# EAGLE board MEM_MUX_2W_1 (EAGLE 6.5.0)
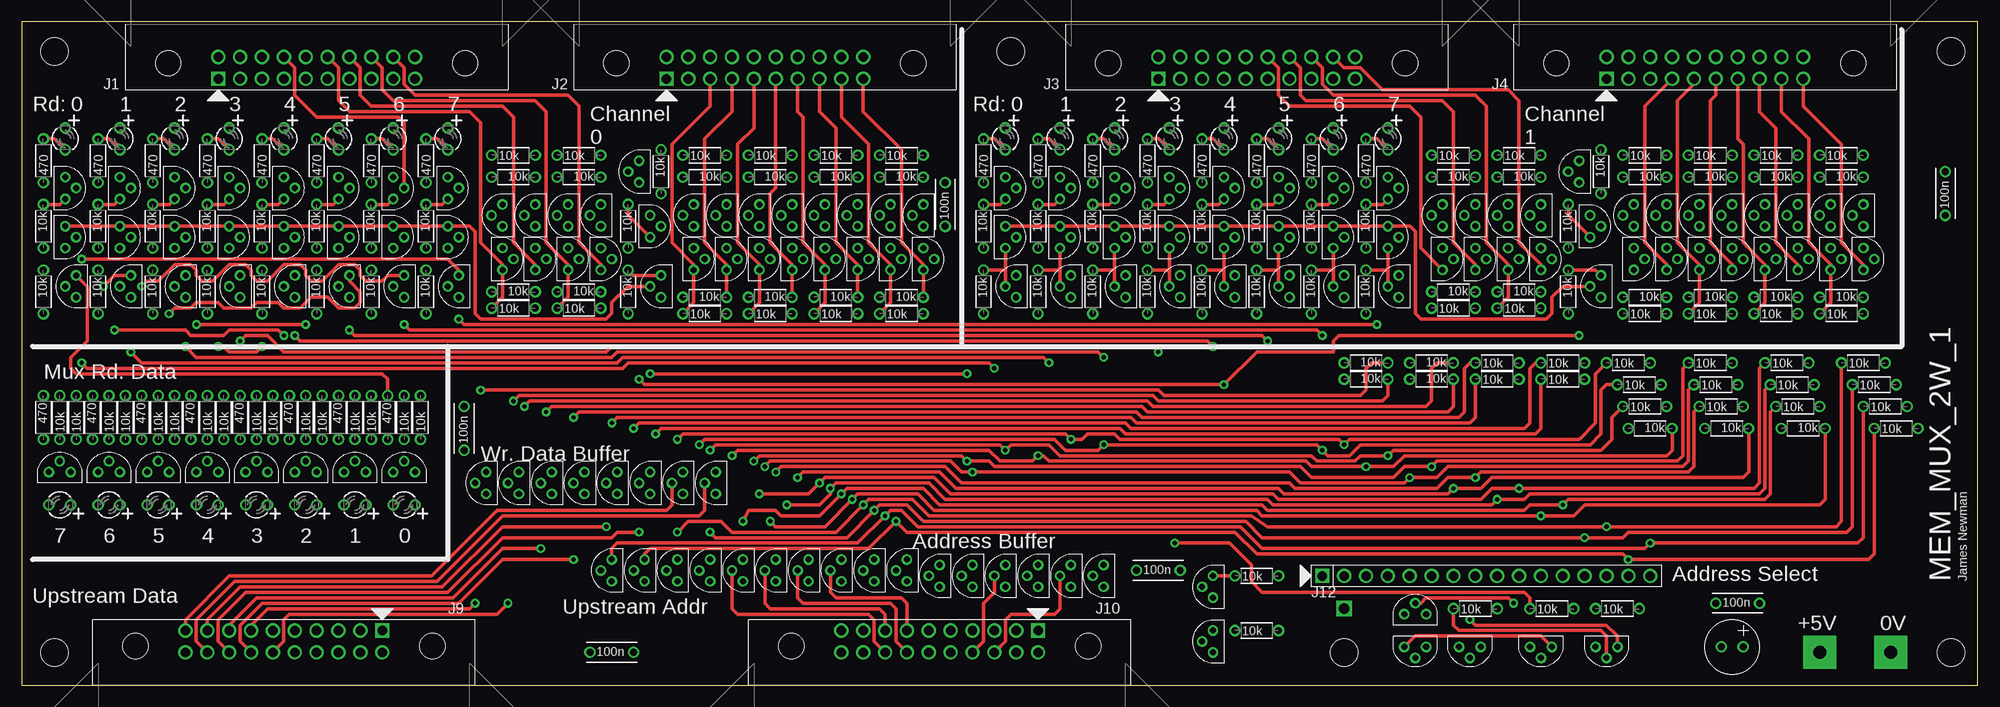
[diagram p12: board, top side]
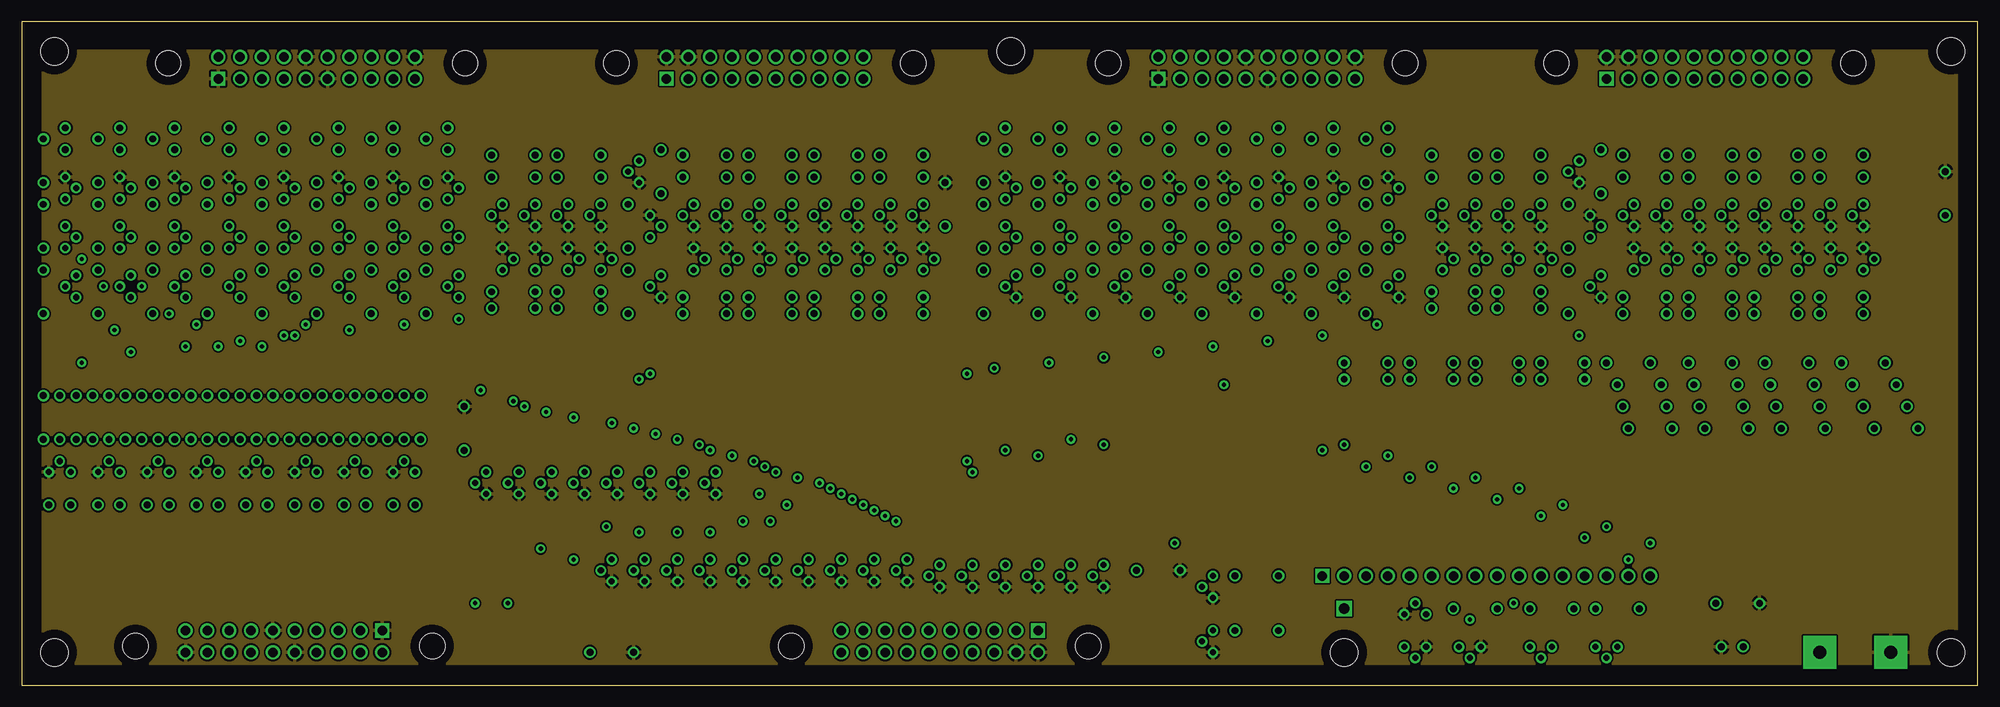
[diagram p13: board, inner layer Route2]
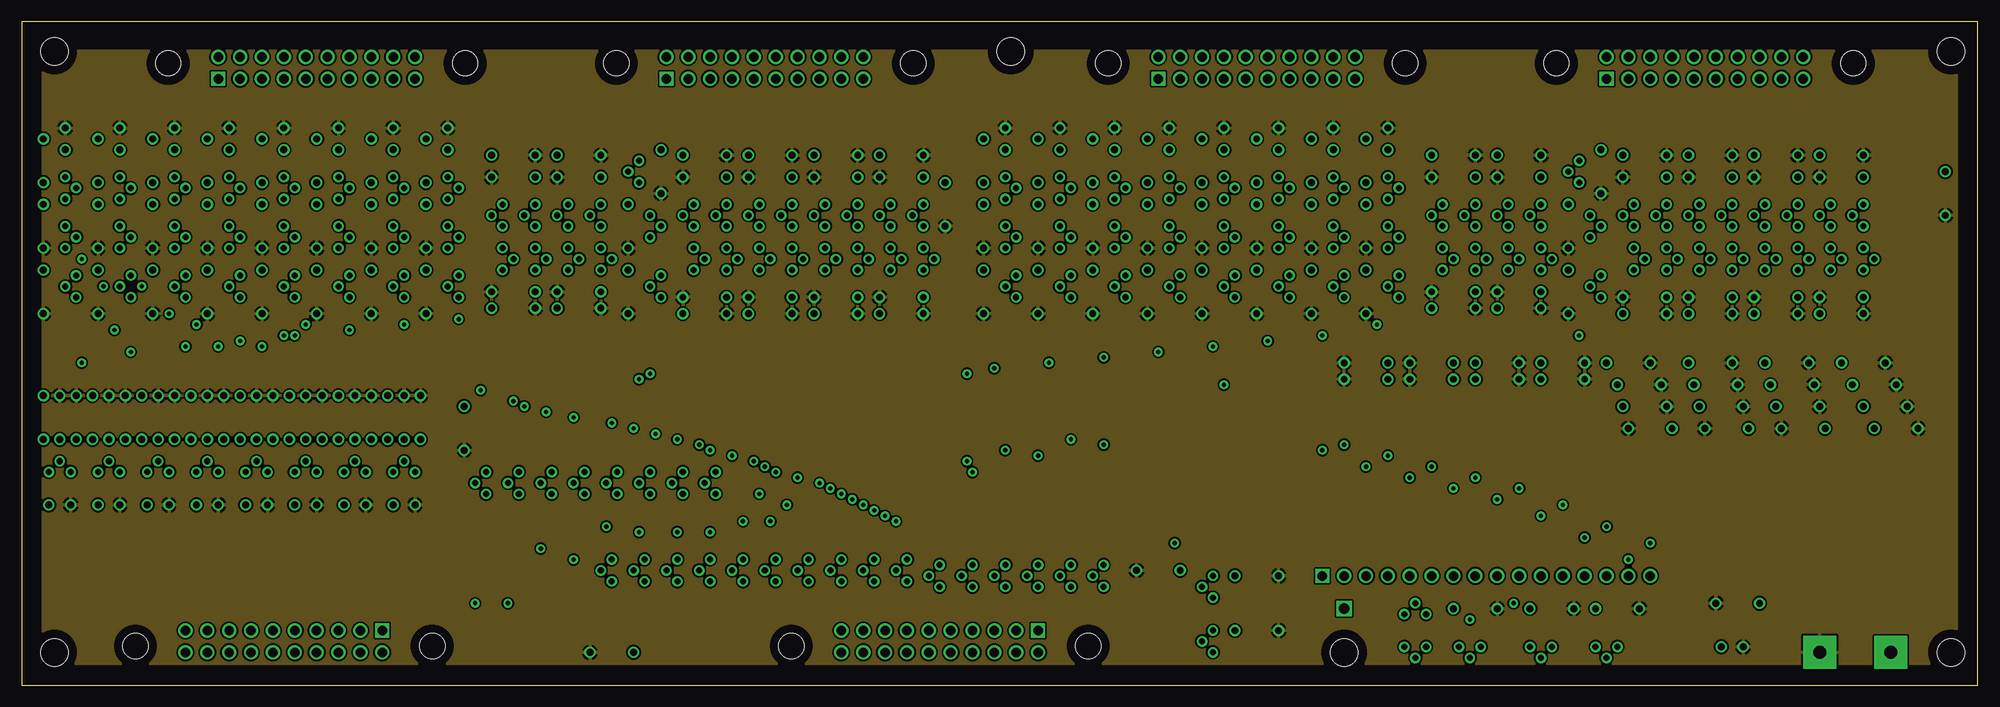
[diagram p14: board, inner layer Route3]
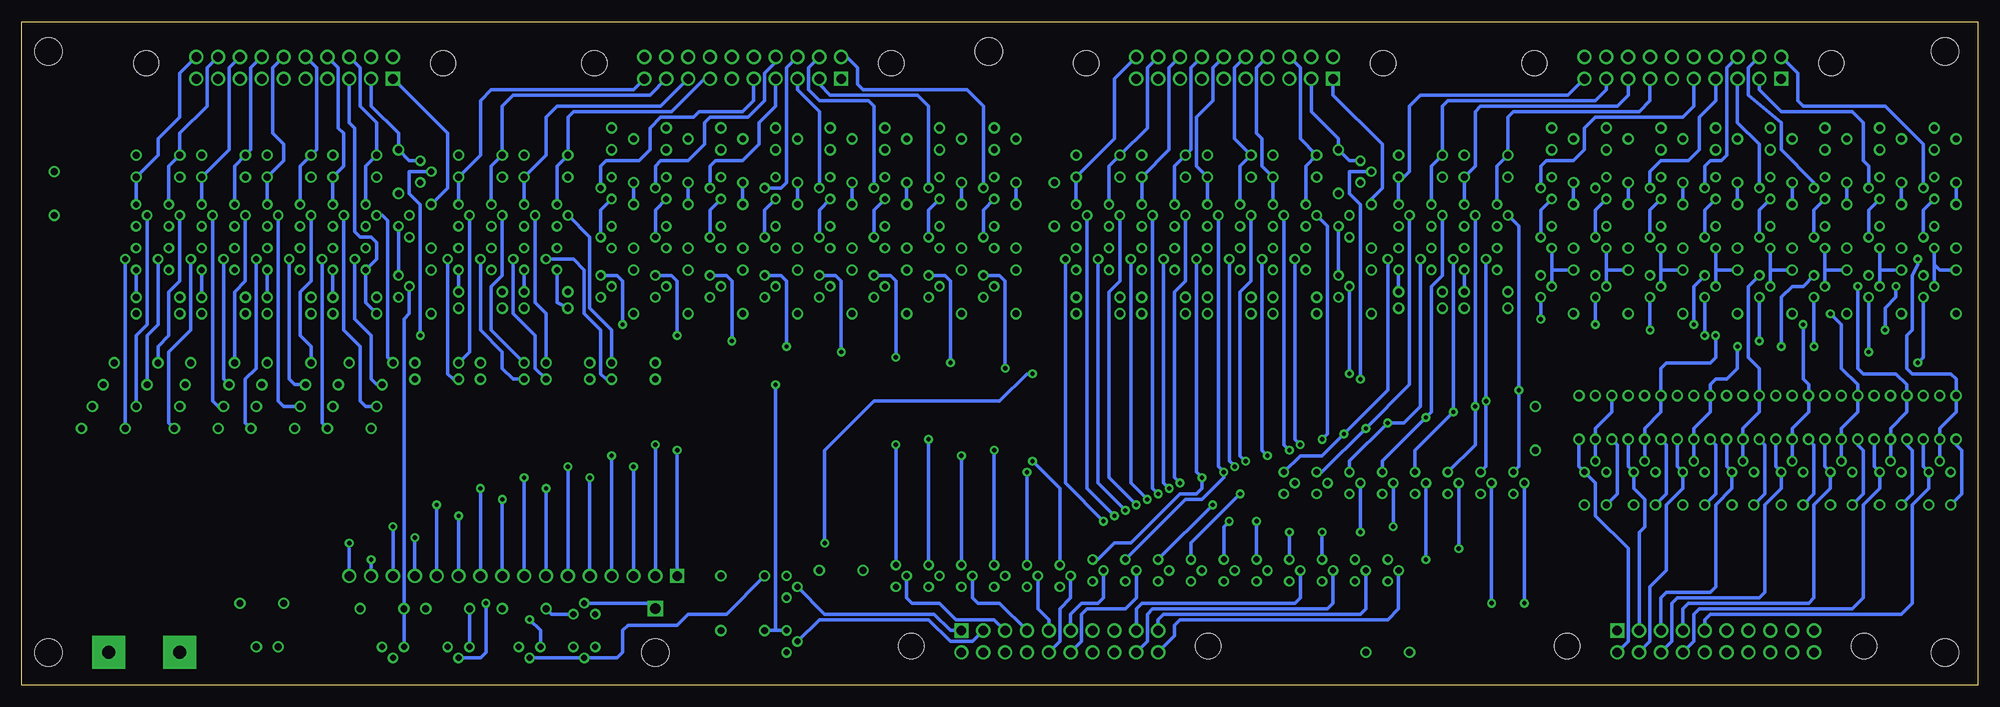
[diagram p15: board, bottom side, seen from below]

Size 227.31 x 77.14 mm. Coordinates in mm from the lower left corner, seen from the top.
Outline: 0,0 227.31,0 227.31,77.14 0,77.14 0,0
Copper layers (1*2+3*16): Top 0.035mm / dielectric 0.2mm / Route2 0.035mm / dielectric 1mm / Route3 0.035mm / dielectric 0.2mm / Bottom 0.035mm
Design rules "processor_rules_4layer": minimum track width 10mil, minimum drill 0.0236mm, track to track 8mil, track to pad 8mil, pad to pad 8mil, via to via 8mil, smd to smd 8mil, copper to edge 40mil, drill to drill 8mil, minimum pad ring 10mil, minimum via ring 8mil, stop-mask expansion 4mil, vias tented up to drill 0.7mm, thermal gap 10mil

## Footprints (pad centres in the part's own frame; a part is rotated, then mirrored left to right if it is on the bottom)
CAP_P2INCH = drill 0.8: 1 -2.54,0; 2 2.54,0
POLARISED_CAP_2P5_6P3MM = drill 0.8: A 1.27,0; K -1.27,0
LED3MM = drill 0.8: A -1.27,0; K 1.27,0
3M_HOLE = hole 3.2: 0,0
20_HDR_LOCKING_RA = drill 1.1 square: 1 -11.43,-1.27 | drill 1.1: 2 -11.43,1.27; 3 -8.89,-1.27; 4 -8.89,1.27; 5 -6.35,-1.27; 6 -6.35,1.27; 7 -3.81,-1.27; 8 -3.81,1.27; 9 -1.27,-1.27; 10 -1.27,1.27; 11 1.27,-1.27; 12 1.27,1.27; 13 3.81,-1.27; 14 3.81,1.27; 15 6.35,-1.27; 16 6.35,1.27; 17 8.89,-1.27; 18 8.89,1.27; 19 11.43,-1.27; 20 11.43,1.27 | hole 2.946: -17.247,0.533; 17.247,0.533
JUMP_16X1 = drill 1.1 square: 1 -19.05,0 | drill 1.1: 2 -16.51,0; 3 -13.97,0; 4 -11.43,0; 5 -8.89,0; 6 -6.35,0; 7 -3.81,0; 8 -1.27,0; 9 1.27,0; 10 3.81,0; 11 6.35,0; 12 8.89,0; 13 11.43,0; 14 13.97,0; 15 16.51,0; 16 19.05,0
TO92-DGS = drill 0.7: D 0,1.27; G -1.27,0; S 0,-1.27
R_P2INCH = drill 0.8: 1 -2.54,0; 2 2.54,0
TEST_LOOP = drill 1.2 square: P$1 0,0
POWER_PAD = drill 1.5 pad 3.81 square: 1 0,0

## Placement (x,y rotation side)
C1  100n  [CAP_P2INCH]  223.52,57.15 90 top
C2  100n  [CAP_P2INCH]  51.44,29.84 90 top
C3  100n  [CAP_P2INCH]  107.31,55.88 90 top
C4  100n  [CAP_P2INCH]  199.39,9.53 0 top
C5  100n  [CAP_P2INCH]  68.58,3.81 0 top
C6  100n  [CAP_P2INCH]  132.08,13.34 0 top
C7  100u  [POLARISED_CAP_2P5_6P3MM]  198.75,4.45 0 top
D1  L-1334SRT  [LED3MM]  5.08,63.5 270 top
D2  L-1334SRT  [LED3MM]  11.43,63.5 270 top
D3  L-1334SRT  [LED3MM]  17.78,63.5 270 top
D4  L-1334SRT  [LED3MM]  24.13,63.5 270 top
D5  L-1334SRT  [LED3MM]  30.48,63.5 270 top
D6  L-1334SRT  [LED3MM]  36.83,63.5 270 top
D7  L-1334SRT  [LED3MM]  43.18,63.5 270 top
D8  L-1334SRT  [LED3MM]  49.53,63.5 270 top
D9  L-1334SRT  [LED3MM]  114.3,63.5 270 top
D10  L-1334SRT  [LED3MM]  120.65,63.5 270 top
D11  L-1334SRT  [LED3MM]  127,63.5 270 top
D12  L-1334SRT  [LED3MM]  133.35,63.5 270 top
D13  L-1334SRT  [LED3MM]  139.7,63.5 270 top
D14  L-1334SRT  [LED3MM]  146.05,63.5 270 top
D15  L-1334SRT  [LED3MM]  152.4,63.5 270 top
D16  L-1334SRT  [LED3MM]  158.75,63.5 270 top
D33  L-1334SRT  [LED3MM]  38.73,20.95 180 top
D34  L-1334SRT  [LED3MM]  33.02,20.95 180 top
D35  L-1334SRT  [LED3MM]  27.3,20.95 180 top
D36  L-1334SRT  [LED3MM]  21.59,20.95 180 top
D37  L-1334SRT  [LED3MM]  15.88,20.95 180 top
D38  L-1334SRT  [LED3MM]  10.16,20.95 180 top
D39  L-1334SRT  [LED3MM]  4.45,20.95 180 top
D69  L-1334SRT  [LED3MM]  44.45,20.95 180 top
H2  3M_MOUNT_HOLE  [3M_HOLE]  3.81,3.81 0 top
H3  3M_MOUNT_HOLE  [3M_HOLE]  3.81,73.66 0 top
H5  3M_MOUNT_HOLE  [3M_HOLE]  114.94,73.66 0 top
H6  3M_MOUNT_HOLE  [3M_HOLE]  224.16,73.66 0 top
H9  3M_MOUNT_HOLE  [3M_HOLE]  224.16,3.81 0 top
H10  3M_MOUNT_HOLE  [3M_HOLE]  153.67,3.81 0 top
J1  20_HDR_LOCKING_RA  [20_HDR_LOCKING_RA]  34.29,71.75 0 top
J2  20_HDR_LOCKING_RA  [20_HDR_LOCKING_RA]  86.36,71.75 0 top
J3  20_HDR_LOCKING_RA  [20_HDR_LOCKING_RA]  143.51,71.75 0 top
J4  20_HDR_LOCKING_RA  [20_HDR_LOCKING_RA]  195.58,71.75 0 top
J9  20_HDR_LOCKING_RA  [20_HDR_LOCKING_RA]  30.48,5.08 180 top
J10  20_HDR_LOCKING_RA  [20_HDR_LOCKING_RA]  106.68,5.08 180 top
J12  JUMP_16X1  [JUMP_16X1]  170.18,12.7 0 top
Q1  2N7000  [TO92-DGS]  5.08,57.78 180 top
Q2  2N7000  [TO92-DGS]  5.08,52.07 180 top
Q3  2N7000  [TO92-DGS]  11.43,57.78 180 top
Q4  2N7000  [TO92-DGS]  11.43,52.07 180 top
Q5  2N7000  [TO92-DGS]  17.78,57.78 180 top
Q6  2N7000  [TO92-DGS]  17.78,52.07 180 top
Q7  2N7000  [TO92-DGS]  24.13,57.78 180 top
Q8  2N7000  [TO92-DGS]  24.13,52.07 180 top
Q9  2N7000  [TO92-DGS]  30.48,57.78 180 top
Q10  2N7000  [TO92-DGS]  30.48,52.07 180 top
Q11  2N7000  [TO92-DGS]  36.83,57.78 180 top
Q12  2N7000  [TO92-DGS]  36.83,52.07 180 top
Q13  2N7000  [TO92-DGS]  43.18,57.78 180 top
Q14  2N7000  [TO92-DGS]  43.18,52.07 180 top
Q15  2N7000  [TO92-DGS]  49.53,57.78 180 top
Q16  2N7000  [TO92-DGS]  49.53,52.07 180 top
Q17  2N7000  [TO92-DGS]  78.11,49.53 180 top
Q18  2N7000  [TO92-DGS]  78.11,54.61 0 top
Q19  2N7000  [TO92-DGS]  81.92,49.53 180 top
Q20  2N7000  [TO92-DGS]  81.92,54.61 0 top
Q21  2N7000  [TO92-DGS]  85.72,49.53 180 top
Q22  2N7000  [TO92-DGS]  85.72,54.61 0 top
Q23  2N7000  [TO92-DGS]  73.03,53.34 180 top
Q24  2N7000  [TO92-DGS]  71.75,59.69 0 top
Q25  2N7000  [TO92-DGS]  55.88,49.53 180 top
Q26  2N7000  [TO92-DGS]  55.88,54.61 0 top
Q27  2N7000  [TO92-DGS]  59.69,49.53 180 top
Q28  2N7000  [TO92-DGS]  59.69,54.61 0 top
Q29  2N7000  [TO92-DGS]  63.5,49.53 180 top
Q30  2N7000  [TO92-DGS]  63.5,54.61 0 top
Q31  2N7000  [TO92-DGS]  67.31,49.53 180 top
Q32  2N7000  [TO92-DGS]  67.31,54.61 0 top
Q33  2N7000  [TO92-DGS]  89.53,49.53 180 top
Q34  2N7000  [TO92-DGS]  89.53,54.61 0 top
Q35  2N7000  [TO92-DGS]  93.34,49.53 180 top
Q36  2N7000  [TO92-DGS]  93.34,54.61 0 top
Q37  2N7000  [TO92-DGS]  97.16,49.53 180 top
Q38  2N7000  [TO92-DGS]  97.16,54.61 0 top
Q39  2N7000  [TO92-DGS]  100.97,49.53 180 top
Q40  2N7000  [TO92-DGS]  100.97,54.61 0 top
Q41  2N7000  [TO92-DGS]  104.78,49.53 180 top
Q42  2N7000  [TO92-DGS]  104.78,54.61 0 top
Q43  2N7000  [TO92-DGS]  114.3,57.78 180 top
Q44  2N7000  [TO92-DGS]  114.3,52.07 180 top
Q45  2N7000  [TO92-DGS]  120.65,57.78 180 top
Q46  2N7000  [TO92-DGS]  120.65,52.07 180 top
Q47  2N7000  [TO92-DGS]  127,57.78 180 top
Q48  2N7000  [TO92-DGS]  127,52.07 180 top
Q49  2N7000  [TO92-DGS]  133.35,57.78 180 top
Q50  2N7000  [TO92-DGS]  133.35,52.07 180 top
Q51  2N7000  [TO92-DGS]  139.7,57.78 180 top
Q52  2N7000  [TO92-DGS]  139.7,52.07 180 top
Q53  2N7000  [TO92-DGS]  146.05,57.78 180 top
Q54  2N7000  [TO92-DGS]  146.05,52.07 180 top
Q55  2N7000  [TO92-DGS]  152.4,57.78 180 top
Q56  2N7000  [TO92-DGS]  152.4,52.07 180 top
Q57  2N7000  [TO92-DGS]  158.75,57.78 180 top
Q58  2N7000  [TO92-DGS]  158.75,52.07 180 top
Q59  2N7000  [TO92-DGS]  182.25,53.34 180 top
Q60  2N7000  [TO92-DGS]  180.97,59.69 0 top
Q61  2N7000  [TO92-DGS]  165.1,49.53 180 top
Q62  2N7000  [TO92-DGS]  165.1,54.61 0 top
Q63  2N7000  [TO92-DGS]  168.91,49.53 180 top
Q64  2N7000  [TO92-DGS]  168.91,54.61 0 top
Q65  2N7000  [TO92-DGS]  172.72,49.53 180 top
Q66  2N7000  [TO92-DGS]  172.72,54.61 0 top
Q67  2N7000  [TO92-DGS]  176.53,49.53 180 top
Q68  2N7000  [TO92-DGS]  176.53,54.61 0 top
Q69  2N7000  [TO92-DGS]  187.32,49.53 180 top
Q70  2N7000  [TO92-DGS]  187.32,54.61 0 top
Q71  2N7000  [TO92-DGS]  191.13,49.53 180 top
Q72  2N7000  [TO92-DGS]  191.13,54.61 0 top
Q73  2N7000  [TO92-DGS]  194.94,49.53 180 top
Q74  2N7000  [TO92-DGS]  194.94,54.61 0 top
Q75  2N7000  [TO92-DGS]  198.75,49.53 180 top
Q76  2N7000  [TO92-DGS]  198.75,54.61 0 top
Q77  2N7000  [TO92-DGS]  202.56,49.53 180 top
Q78  2N7000  [TO92-DGS]  202.56,54.61 0 top
Q79  2N7000  [TO92-DGS]  206.38,49.53 180 top
Q80  2N7000  [TO92-DGS]  206.38,54.61 0 top
Q81  2N7000  [TO92-DGS]  210.19,49.53 180 top
Q82  2N7000  [TO92-DGS]  210.19,54.61 0 top
Q83  2N7000  [TO92-DGS]  214,49.53 180 top
Q84  2N7000  [TO92-DGS]  214,54.61 0 top
Q169  2N7000  [TO92-DGS]  6.35,46.35 0 top
Q170  2N7000  [TO92-DGS]  44.45,24.77 270 top
Q171  2N7000  [TO92-DGS]  115.57,46.35 0 top
Q174  2N7000  [TO92-DGS]  12.7,46.35 0 top
Q175  2N7000  [TO92-DGS]  38.73,24.77 270 top
Q176  2N7000  [TO92-DGS]  121.92,46.35 0 top
Q179  2N7000  [TO92-DGS]  19.05,46.35 0 top
Q180  2N7000  [TO92-DGS]  33.02,24.77 270 top
Q181  2N7000  [TO92-DGS]  128.27,46.35 0 top
Q184  2N7000  [TO92-DGS]  25.4,46.35 0 top
Q185  2N7000  [TO92-DGS]  27.3,24.77 270 top
Q186  2N7000  [TO92-DGS]  134.62,46.35 0 top
Q189  2N7000  [TO92-DGS]  31.75,46.35 0 top
Q190  2N7000  [TO92-DGS]  21.59,24.77 270 top
Q191  2N7000  [TO92-DGS]  140.97,46.35 0 top
Q194  2N7000  [TO92-DGS]  38.1,46.35 0 top
Q195  2N7000  [TO92-DGS]  15.88,24.77 270 top
Q196  2N7000  [TO92-DGS]  147.32,46.35 0 top
Q199  2N7000  [TO92-DGS]  44.45,46.35 0 top
Q200  2N7000  [TO92-DGS]  10.16,24.77 270 top
Q201  2N7000  [TO92-DGS]  153.67,46.35 0 top
Q204  2N7000  [TO92-DGS]  50.8,46.35 0 top
Q205  2N7000  [TO92-DGS]  4.45,24.77 270 top
Q206  2N7000  [TO92-DGS]  160.02,46.35 0 top
Q209  2N7000  [TO92-DGS]  57.78,23.5 0 top
Q210  2N7000  [TO92-DGS]  53.98,23.5 0 top
Q211  2N7000  [TO92-DGS]  65.41,23.5 0 top
Q212  2N7000  [TO92-DGS]  61.59,23.5 0 top
Q213  2N7000  [TO92-DGS]  73.03,23.5 0 top
Q214  2N7000  [TO92-DGS]  69.22,23.5 0 top
Q215  2N7000  [TO92-DGS]  80.64,23.5 0 top
Q216  2N7000  [TO92-DGS]  76.83,23.5 0 top
Q217  2N7000  [TO92-DGS]  125.73,12.7 0 top
Q218  2N7000  [TO92-DGS]  121.92,12.7 0 top
Q219  2N7000  [TO92-DGS]  118.11,12.7 0 top
Q220  2N7000  [TO92-DGS]  114.3,12.7 0 top
Q221  2N7000  [TO92-DGS]  110.49,12.7 0 top
Q222  2N7000  [TO92-DGS]  106.68,12.7 0 top
Q223  2N7000  [TO92-DGS]  102.87,13.34 0 top
Q224  2N7000  [TO92-DGS]  99.06,13.34 0 top
Q225  2N7000  [TO92-DGS]  95.25,13.34 0 top
Q226  2N7000  [TO92-DGS]  91.44,13.34 0 top
Q227  2N7000  [TO92-DGS]  87.63,13.34 0 top
Q228  2N7000  [TO92-DGS]  83.82,13.34 0 top
Q229  2N7000  [TO92-DGS]  80.01,13.34 0 top
Q230  2N7000  [TO92-DGS]  76.2,13.34 0 top
Q231  2N7000  [TO92-DGS]  72.39,13.34 0 top
Q232  2N7000  [TO92-DGS]  68.58,13.34 0 top
Q233  2N7000  [TO92-DGS]  161.93,8.26 270 top
Q235  2N7000  [TO92-DGS]  138.43,11.43 0 top
Q236  2N7000  [TO92-DGS]  138.43,5.08 0 top
Q237  2N7000  [TO92-DGS]  176.53,4.45 90 top
Q239  2N7000  [TO92-DGS]  161.93,4.45 90 top
Q240  2N7000  [TO92-DGS]  74.3,46.35 0 top
Q241  2N7000  [TO92-DGS]  184.15,4.45 90 top
Q243  2N7000  [TO92-DGS]  168.28,4.45 90 top
Q244  2N7000  [TO92-DGS]  183.51,46.35 0 top
R1  10k  [R_P2INCH]  2.54,53.34 270 top
R2  470  [R_P2INCH]  2.54,60.96 90 top
R3  10k  [R_P2INCH]  8.89,53.34 270 top
R4  470  [R_P2INCH]  8.89,60.96 90 top
R5  10k  [R_P2INCH]  15.24,53.34 270 top
R6  470  [R_P2INCH]  15.24,60.96 90 top
R7  10k  [R_P2INCH]  21.59,53.34 270 top
R8  470  [R_P2INCH]  21.59,60.96 90 top
R9  10k  [R_P2INCH]  27.94,53.34 270 top
R10  470  [R_P2INCH]  27.94,60.96 90 top
R11  10k  [R_P2INCH]  34.29,53.34 270 top
R12  470  [R_P2INCH]  34.29,60.96 90 top
R13  10k  [R_P2INCH]  40.64,53.34 270 top
R14  470  [R_P2INCH]  40.64,60.96 90 top
R15  10k  [R_P2INCH]  46.99,53.34 270 top
R16  470  [R_P2INCH]  46.99,60.96 90 top
R17  10k  [R_P2INCH]  2.54,45.72 270 top
R18  10k  [R_P2INCH]  8.89,45.72 270 top
R19  10k  [R_P2INCH]  15.24,45.72 270 top
R20  10k  [R_P2INCH]  21.59,45.72 270 top
R21  10k  [R_P2INCH]  27.94,45.72 270 top
R22  10k  [R_P2INCH]  34.29,45.72 270 top
R23  10k  [R_P2INCH]  40.64,45.72 270 top
R24  10k  [R_P2INCH]  46.99,45.72 270 top
R25  10k  [R_P2INCH]  79.38,43.18 0 top
R26  10k  [R_P2INCH]  79.38,61.59 0 top
R27  10k  [R_P2INCH]  79.38,45.09 180 top
R28  10k  [R_P2INCH]  79.38,59.05 180 top
R29  10k  [R_P2INCH]  87,43.18 0 top
R30  10k  [R_P2INCH]  87,61.59 0 top
R31  10k  [R_P2INCH]  70.48,53.34 270 top
R32  10k  [R_P2INCH]  74.3,59.69 270 top
R33  10k  [R_P2INCH]  57.15,43.81 0 top
R34  10k  [R_P2INCH]  57.15,61.59 0 top
R35  10k  [R_P2INCH]  57.15,45.72 180 top
R36  10k  [R_P2INCH]  57.15,59.05 180 top
R37  10k  [R_P2INCH]  64.77,43.81 0 top
R38  10k  [R_P2INCH]  64.77,61.59 0 top
R39  10k  [R_P2INCH]  64.77,45.72 180 top
R40  10k  [R_P2INCH]  64.77,59.05 180 top
R41  10k  [R_P2INCH]  87,45.09 180 top
R42  10k  [R_P2INCH]  87,59.05 180 top
R43  10k  [R_P2INCH]  94.61,43.18 0 top
R44  10k  [R_P2INCH]  94.61,61.59 0 top
R45  10k  [R_P2INCH]  94.61,45.09 180 top
R46  10k  [R_P2INCH]  94.61,59.05 180 top
R47  10k  [R_P2INCH]  102.23,43.18 0 top
R48  10k  [R_P2INCH]  102.23,61.59 0 top
R49  10k  [R_P2INCH]  102.23,45.09 180 top
R50  10k  [R_P2INCH]  102.23,59.05 180 top
R51  10k  [R_P2INCH]  111.76,53.34 270 top
R52  470  [R_P2INCH]  111.76,60.96 90 top
R53  10k  [R_P2INCH]  118.11,53.34 270 top
R54  470  [R_P2INCH]  118.11,60.96 90 top
R55  10k  [R_P2INCH]  124.46,53.34 270 top
R56  470  [R_P2INCH]  124.46,60.96 90 top
R57  10k  [R_P2INCH]  130.81,53.34 270 top
R58  470  [R_P2INCH]  130.81,60.96 90 top
R59  10k  [R_P2INCH]  137.16,53.34 270 top
R60  470  [R_P2INCH]  137.16,60.96 90 top
R61  10k  [R_P2INCH]  143.51,53.34 270 top
R62  470  [R_P2INCH]  143.51,60.96 90 top
R63  10k  [R_P2INCH]  149.86,53.34 270 top
R64  470  [R_P2INCH]  149.86,60.96 90 top
R65  10k  [R_P2INCH]  156.21,53.34 270 top
R66  470  [R_P2INCH]  156.21,60.96 90 top
R67  10k  [R_P2INCH]  111.76,45.72 270 top
R68  10k  [R_P2INCH]  118.11,45.72 270 top
R69  10k  [R_P2INCH]  124.46,45.72 270 top
R70  10k  [R_P2INCH]  130.81,45.72 270 top
R71  10k  [R_P2INCH]  137.16,45.72 270 top
R72  10k  [R_P2INCH]  143.51,45.72 270 top
R73  10k  [R_P2INCH]  149.86,45.72 270 top
R74  10k  [R_P2INCH]  156.21,45.72 270 top
R75  10k  [R_P2INCH]  179.71,53.34 270 top
R76  10k  [R_P2INCH]  183.51,59.69 270 top
R77  10k  [R_P2INCH]  166.37,43.81 0 top
R78  10k  [R_P2INCH]  166.37,61.59 0 top
R79  10k  [R_P2INCH]  166.37,45.72 180 top
R80  10k  [R_P2INCH]  166.37,59.05 180 top
R81  10k  [R_P2INCH]  173.99,43.81 0 top
R82  10k  [R_P2INCH]  173.99,61.59 0 top
R83  10k  [R_P2INCH]  173.99,45.72 180 top
R84  10k  [R_P2INCH]  173.99,59.05 180 top
R85  10k  [R_P2INCH]  188.59,43.18 0 top
R86  10k  [R_P2INCH]  188.59,61.59 0 top
R87  10k  [R_P2INCH]  188.59,45.09 180 top
R88  10k  [R_P2INCH]  188.59,59.05 180 top
R89  10k  [R_P2INCH]  196.22,43.18 0 top
R90  10k  [R_P2INCH]  196.22,61.59 0 top
R91  10k  [R_P2INCH]  196.22,45.09 180 top
R92  10k  [R_P2INCH]  196.22,59.05 180 top
R93  10k  [R_P2INCH]  203.84,43.18 0 top
R94  10k  [R_P2INCH]  203.84,61.59 0 top
R95  10k  [R_P2INCH]  203.84,45.09 180 top
R96  10k  [R_P2INCH]  203.84,59.05 180 top
R97  10k  [R_P2INCH]  211.46,43.18 0 top
R98  10k  [R_P2INCH]  211.46,61.59 0 top
R99  10k  [R_P2INCH]  211.46,45.09 180 top
R100  10k  [R_P2INCH]  211.46,59.05 180 top
R201  10k  [R_P2INCH]  44.45,31.11 90 top
R202  470  [R_P2INCH]  42.55,31.11 270 top
R203  10k  [R_P2INCH]  38.73,31.11 90 top
R204  470  [R_P2INCH]  36.83,31.11 270 top
R205  10k  [R_P2INCH]  33.02,31.11 90 top
R206  470  [R_P2INCH]  31.11,31.11 270 top
R207  10k  [R_P2INCH]  27.3,31.11 90 top
R208  470  [R_P2INCH]  25.4,31.11 270 top
R209  10k  [R_P2INCH]  21.59,31.11 90 top
R210  470  [R_P2INCH]  19.68,31.11 270 top
R211  10k  [R_P2INCH]  15.88,31.11 90 top
R212  470  [R_P2INCH]  13.97,31.11 270 top
R213  10k  [R_P2INCH]  10.16,31.11 90 top
R214  470  [R_P2INCH]  8.26,31.11 270 top
R215  10k  [R_P2INCH]  4.45,31.11 90 top
R216  470  [R_P2INCH]  2.54,31.11 270 top
R217  10k  [R_P2INCH]  156.21,35.56 180 top
R218  10k  [R_P2INCH]  156.21,37.47 180 top
R219  10k  [R_P2INCH]  163.83,35.56 180 top
R220  10k  [R_P2INCH]  163.83,37.47 180 top
R221  10k  [R_P2INCH]  171.45,35.56 0 top
R222  10k  [R_P2INCH]  171.45,37.47 0 top
R223  10k  [R_P2INCH]  179.07,35.56 0 top
R224  10k  [R_P2INCH]  179.07,37.47 0 top
R225  10k  [R_P2INCH]  187.96,34.92 0 top
R226  10k  [R_P2INCH]  186.69,37.47 0 top
R227  10k  [R_P2INCH]  189.23,29.84 180 top
R228  10k  [R_P2INCH]  188.59,32.38 0 top
R229  10k  [R_P2INCH]  196.85,34.92 0 top
R230  10k  [R_P2INCH]  196.22,37.47 0 top
R231  10k  [R_P2INCH]  198.12,29.84 180 top
R232  10k  [R_P2INCH]  197.49,32.38 0 top
R233  10k  [R_P2INCH]  205.74,34.92 0 top
R234  10k  [R_P2INCH]  205.1,37.47 0 top
R235  10k  [R_P2INCH]  207.01,29.84 180 top
R236  10k  [R_P2INCH]  206.38,32.38 0 top
R237  10k  [R_P2INCH]  215.26,34.92 0 top
R238  10k  [R_P2INCH]  214,37.47 0 top
R239  10k  [R_P2INCH]  217.81,29.84 0 top
R240  10k  [R_P2INCH]  216.53,32.38 0 top
R241  10k  [R_P2INCH]  168.91,8.89 0 top
R243  10k  [R_P2INCH]  143.51,12.7 0 top
R244  10k  [R_P2INCH]  143.51,6.35 0 top
R245  10k  [R_P2INCH]  177.8,8.89 0 top
R246  10k  [R_P2INCH]  70.48,45.72 270 top
R247  10k  [R_P2INCH]  185.42,8.89 0 top
R248  10k  [R_P2INCH]  179.71,45.72 270 top
R253  10k  [R_P2INCH]  23.5,31.11 90 top
R254  10k  [R_P2INCH]  17.78,31.11 90 top
R255  10k  [R_P2INCH]  12.06,31.11 90 top
R256  10k  [R_P2INCH]  6.35,31.11 90 top
R257  10k  [R_P2INCH]  46.35,31.11 90 top
R258  10k  [R_P2INCH]  40.64,31.11 90 top
R259  10k  [R_P2INCH]  34.92,31.11 90 top
R260  10k  [R_P2INCH]  29.21,31.11 90 top
TP1  [TEST_LOOP]  153.67,8.89 0 top
TP5  POWER_PAD  [POWER_PAD]  208.91,3.81 0 top
TP6  POWER_PAD  [POWER_PAD]  217.17,3.81 0 top

## Tracks (layer width: path | path; a pad name or v marks a point on that pad's centre or on a via)
+5V
  pour Route3: 2.54,2.54 2.54,73.66 224.79,73.66 224.79,2.54
A0
  Bottom 0.406: J10.5 114.3,7.62 118.75,7.62 120.65,9.53 123.83,9.53 124.46,10.16 Q217.G
A0_N  (via drill 0.5 pad 1.02)
  Top 0.406: v78.74,27.94 79.38,28.57 120.02,28.57 121.28,27.3 125.09,27.3 v125.73,27.94 150.5,27.94 v151.13,27.3 151.76,26.67 154.31,26.67 155.57,27.94 182.25,27.94 183.51,29.21 183.51,34.29 184.15,34.92 R225.1
  Bottom 0.406: Q17.G 79.38,28.57 v78.74,27.94 | v125.73,27.94 Q217.D | v151.13,27.3 J12.1 | Q69.G 188.59,42.55 186.69,40.64 186.69,35.56 186.06,34.92 R225.1
A1
  Top 0.406: J10.6 114.3,5.08 114.3,7.62 114.94,8.26 120.02,8.26 120.65,8.89 Q218.G
A1_N  (via drill 0.5 pad 1.02)
  Top 0.406: v76.2,28.57 76.83,29.21 121.28,29.21 v121.92,28.57 123.19,28.57 123.83,29.21 127,29.21 127.64,28.57 153.03,28.57 v153.67,27.94 154.31,28.57 180.97,28.57 182.88,30.48 182.88,36.2 R226.1
  Bottom 0.406: Q18.G 75.56,53.34 75.56,29.21 v76.2,28.57 | Q70.G 185.42,54.61 184.78,53.98 184.78,38.1 R226.1 | v121.92,28.57 Q218.D | v153.67,27.94 J12.2
A2
  Bottom 0.406: J10.7 113.67,9.53 116.2,9.53 116.84,10.16 Q219.G
A2_N  (via drill 0.5 pad 1.02)
  Top 0.406: v82.55,26.67 83.19,27.3 112.39,27.3 113.67,26.04 117.47,26.04 v118.11,26.67 118.75,26.67 119.38,26.04 149.22,26.04 149.86,25.4 v156.21,25.4 159.38,25.4 160.66,26.67 191.13,26.67 191.77,27.3 R227.1
  Bottom 0.406: Q19.G 83.19,27.3 v82.55,26.67 | v118.11,26.67 Q219.D | v156.21,25.4 J12.3 | Q71.G 192.41,30.48 R227.1
A3
  Top 0.406: J10.8 111.76,5.08 111.76,9.53 113.03,10.79 Q220.G
A3_N  (via drill 0.5 pad 1.02)
  Top 0.406: v80.01,27.3 80.64,27.94 113.67,27.94 v114.3,27.3 114.94,27.94 119.38,27.94 120.65,26.67 149.86,26.67 150.5,26.04 154.94,26.04 155.57,26.67 v158.75,26.67 159.38,27.3 183.51,27.3 184.78,28.57 184.78,31.11 R228.1
  Bottom 0.406: Q20.G 80.64,27.94 v80.01,27.3 | v114.3,27.3 Q220.D | v158.75,26.67 J12.4 | Q72.G 189.87,41.27 187.96,39.37 187.96,33.02 187.32,32.38 R228.1
A4
  Bottom 0.406: J10.9 107.95,7.62 109.22,8.89 Q221.G
A4_N  (via drill 0.5 pad 1.02)
  Top 0.406: v86.36,25.4 87,26.04 107.95,26.04 109.22,24.77 v110.49,24.77 147.32,24.77 148.59,23.5 160.66,23.5 v161.29,24.13 164.47,24.13 165.74,25.4 193.04,25.4 193.68,26.04 193.68,34.29 R229.1
  Bottom 0.406: Q21.G 87,26.04 v86.36,25.4 | v110.49,24.77 Q221.D | v161.29,24.13 J12.5 | Q73.G 196.22,35.56 195.58,34.92 R229.1
A5
  Bottom 0.406: J10.10 106.68,5.08 106.68,8.89 105.41,10.16 Q222.G
A5_N  (via drill 0.5 pad 1.02)
  Top 0.406: v85.09,26.04 85.72,26.67 109.22,26.67 v109.86,26.04 112.39,26.04 113.03,25.4 148.59,25.4 149.86,24.13 159.38,24.13 160.66,25.4 v163.83,25.4 164.47,26.04 192.41,26.04 193.04,26.67 193.04,36.83 R230.1
  Bottom 0.406: Q22.G 84.45,46.99 85.72,45.72 85.72,26.67 v85.09,26.04 | Q74.G 193.68,46.99 194.94,45.72 194.94,40.64 193.68,39.37 R230.1 | v109.86,26.04 106.68,22.86 Q222.D | v163.83,25.4 J12.6
A6
  Bottom 0.406: J10.11 105.41,8.26 104.14,9.53 102.23,9.53 101.6,10.16 Q223.G
A6_N  (via drill 0.5 pad 1.02)
  Top 0.406: v90.17,24.13 90.81,24.77 106.68,24.77 108.58,22.86 146.05,22.86 146.69,22.23 165.74,22.23 v166.37,22.86 169.54,22.86 170.81,24.13 200.03,24.13 200.66,24.77 R231.1
  Bottom 0.406: Q33.G 90.81,24.77 v90.17,24.13 90.17,22.86 90.81,22.23 92.71,22.23 98.42,16.51 100.33,16.51 102.23,14.61 Q223.D | v166.37,22.86 J12.7 | Q75.G 200.03,36.83 201.29,35.56 201.29,30.48 R231.1
A7
  Bottom 0.406: J10.12 104.14,5.08 104.14,8.26 103.5,8.89 99.06,8.89 97.79,10.16 Q224.G
A7_N  (via drill 0.5 pad 1.02)
  Top 0.406: v87.63,24.77 88.27,25.4 107.31,25.4 109.22,23.5 147.32,23.5 147.96,22.86 164.47,22.86 165.74,24.13 v168.91,24.13 169.54,24.77 193.68,24.77 194.31,25.4 194.31,31.75 R232.1
  Bottom 0.406: Q34.G 88.27,25.4 v87.63,24.77 87.63,24.13 90.17,21.59 92.08,21.59 Q224.D | v168.91,24.13 J12.8 | Q76.G 197.49,33.02 196.85,32.38 R232.1
A8
  Top 0.406: J10.13 102.87,9.53 102.23,10.16 94.61,10.16 93.98,10.79 Q225.G
A8_N  (via drill 0.5 pad 1.02)
  Top 0.406: v88.9,20.95 92.71,20.95 93.98,22.23 v93.98,22.86 94.61,23.5 105.41,23.5 107.31,21.59 144.78,21.59 145.41,20.95 170.81,20.95 v171.45,21.59 174.62,21.59 175.26,22.23 201.93,22.23 202.56,22.86 202.56,34.29 R233.1
  Bottom 0.406: Q35.G 94.61,23.5 v93.98,22.86 | Q225.D v88.9,20.95 | v171.45,21.59 J12.9 | Q77.G 203.84,35.56 R233.1
A9
  Top 0.406: J10.14 101.6,5.08 101.6,8.89 100.97,9.53 90.81,9.53 90.17,10.16 Q226.G
A9_N  (via drill 0.5 pad 1.02)
  Top 0.406: v85.72,22.23 91.44,22.23 v92.71,23.5 93.34,24.13 106.05,24.13 107.95,22.23 145.41,22.23 146.05,21.59 169.54,21.59 170.81,22.86 v173.99,22.86 201.29,22.86 201.93,23.5 201.93,36.83 R234.1
  Bottom 0.406: Q36.G 92.08,46.99 93.34,45.72 93.34,24.13 v92.71,23.5 | Q78.G 201.29,46.99 202.56,45.72 R234.1 | Q226.D 91.44,16.51 v85.72,22.23 | v173.99,22.86 J12.10
A10
  Top 0.406: J10.15 100.33,8.26 99.69,8.89 87,8.89 86.36,9.53 Q227.G
A10_N  (via drill 0.5 pad 1.02)
  Top 0.406: v87,19.05 87.63,18.41 93.34,18.41 v96.52,21.59 97.16,22.23 104.14,22.23 106.05,20.32 143.51,20.32 144.15,19.68 v176.53,19.68 180.34,19.68 181.61,20.95 208.91,20.95 209.55,21.59 R235.1
  Bottom 0.406: Q37.G 98.42,23.5 v96.52,21.59 | Q227.D 87.63,18.41 v87,19.05 | Q79.G 207.65,41.27 210.19,38.73 210.19,30.48 R235.1 | v176.53,19.68 J12.11
A11
  Top 0.406: J10.16 99.06,5.08 99.06,7.62 98.42,8.26 83.19,8.26 82.55,8.89 Q228.G
A11_N  (via drill 0.5 pad 1.02)
  Top 0.406: v83.82,19.05 84.45,20.32 87.63,20.32 88.27,19.68 92.71,19.68 v95.25,22.23 95.89,22.86 104.78,22.86 106.68,20.95 144.15,20.95 144.78,20.32 174.62,20.32 175.26,20.95 v179.07,20.95 179.71,21.59 202.56,21.59 203.2,22.23 203.2,31.75 R236.1
  Bottom 0.406: Q38.G 95.89,22.86 v95.25,22.23 | Q228.D v83.82,19.05 | Q80.G 205.1,33.02 204.47,32.38 R236.1 | v179.07,20.95 J12.12
A12
  Bottom 0.406: J10.17 97.79,8.89 97.16,9.53 79.38,9.53 78.74,10.16 Q229.G
A12_N  (via drill 0.5 pad 1.02)
  Top 0.406: v80.01,17.78 80.64,17.14 95.89,17.14 v99.06,20.32 99.69,20.95 102.87,20.95 104.78,19.05 142.24,19.05 144.15,17.14 v181.61,17.14 186.06,17.14 186.69,17.78 212.09,17.78 212.72,18.41 R237.1
  Bottom 0.406: Q39.G 102.23,23.5 v99.06,20.32 | v80.01,17.78 Q229.D | Q81.G 211.46,41.91 212.72,40.64 R237.1 | v181.61,17.14 J12.13
A13
  Bottom 0.406: J10.18 96.52,5.08 96.52,8.26 95.89,8.89 75.56,8.89 74.93,9.53 Q230.G
A13_N  (via drill 0.5 pad 1.02)
  Top 0.406: v76.2,17.78 77.47,19.05 81.28,19.05 82.55,17.78 94.61,17.78 v97.79,20.95 98.42,21.59 103.5,21.59 105.41,19.68 142.88,19.68 144.78,18.41 v184.15,18.41 210.82,18.41 211.46,19.05 R238.1
  Bottom 0.406: Q40.G 99.69,46.99 100.97,45.72 100.97,24.13 v97.79,20.95 | Q82.G 208.91,46.99 210.19,45.72 210.19,40.64 211.46,39.37 R238.1 | v76.2,17.78 Q230.D | v184.15,18.41 J12.14
A14
  Bottom 0.406: J10.19 95.25,7.62 94.61,8.26 71.75,8.26 71.12,8.89 Q231.G
A14_N  (via drill 0.5 pad 1.02)
  Top 0.406: Q231.D 72.39,15.24 73.03,15.88 98.42,15.88 v101.6,19.05 102.87,17.78 140.97,17.78 143.51,15.24 186.06,15.24 v186.69,14.61 214.63,14.61 215.26,15.24 R239.1
  Bottom 0.406: Q41.G 106.05,23.5 v101.6,19.05 | Q83.G R239.1 | v186.69,14.61 J12.15
A15
  Bottom 0.406: J10.20 93.34,5.71 93.34,6.99 92.71,7.62 68.58,7.62 67.31,8.89 Q232.G
A15_N  (via drill 0.5 pad 1.02)
  Top 0.406: Q232.D 68.58,15.88 69.22,16.51 97.16,16.51 v100.33,19.68 100.97,20.32 102.23,20.32 104.14,18.41 141.6,18.41 144.15,15.88 188.59,15.88 v189.23,16.51 213.36,16.51 214,17.14 R240.1
  Bottom 0.406: Q42.G 103.5,22.86 v100.33,19.68 | Q84.G 212.72,41.91 214,40.64 R240.1 | v189.23,16.51 J12.16
CS
  Top 0.406: Q235.D R243.1
  Bottom 0.406: Q243.G Q239.G 158.12,3.17 157.48,3.81 157.48,6.35 156.84,6.99 151.13,6.99 149.86,8.26 145.41,8.26 R243.1
CS_0_N  (via drill 0.5 pad 1.02)
  Top 0.406: v73.03,36.2 v109.86,36.2 | Q2.S Q4.S Q6.S Q8.S Q10.S Q12.S Q14.S Q16.S 52.07,53.34 52.7,52.7 52.7,43.18 53.34,42.55 67.94,42.55 68.58,43.18 68.58,44.45 70.48,46.35 Q240.G | v133.99,16.51 140.34,16.51 142.88,13.97 142.88,12.06 144.15,10.79 174.62,10.79 175.26,10.16 R245.1
  Bottom 0.406: Q240.G v73.03,36.2 | v109.86,36.2 110.49,36.2 113.67,33.02 128.27,33.02 133.99,27.3 v133.99,16.51 | R245.1 Q237.D
CS_1_N
  Top 0.406: Q44.S Q46.S Q48.S Q50.S Q52.S Q54.S Q56.S Q58.S 161.29,53.34 161.93,52.7 161.93,43.18 162.56,42.55 177.16,42.55 177.8,43.18 177.8,45.09 179.07,46.35 Q244.G
  Bottom 0.406: Q244.G 182.25,43.18 182.88,42.55 R247.1 Q241.D
CS_N
  Bottom 0.406: J10.1 119.38,6.35 121.28,8.26 133.99,8.26 Q235.G
GND
  pour Route2: 2.54,2.54 2.54,73.66 224.79,73.66 224.79,2.54
N$1
  Top 0.406: R3.1 10.79,55.88 Q3.D
  Bottom 0.406: Q4.G 12.7,55.24 Q3.D | R3.1 R4.1
N$2
  Top 0.406: R1.1 4.45,55.88 Q1.D
  Bottom 0.406: Q2.G 6.35,55.24 Q1.D | R1.1 R2.1
N$3
  Top 0.406: R2.2 3.81,63.5 D1.K
N$4
  Top 0.406: R4.2 10.16,63.5 D2.K
N$5
  Top 0.406: R5.1 17.14,55.88 Q5.D
  Bottom 0.406: Q6.G 19.05,55.24 Q5.D | R5.1 R6.1
N$6
  Top 0.406: R6.2 16.51,63.5 D3.K
N$7
  Top 0.406: R7.1 23.5,55.88 Q7.D
  Bottom 0.406: Q8.G 25.4,55.24 Q7.D | R7.1 R8.1
N$8
  Top 0.406: R8.2 22.86,63.5 D4.K
N$9
  Top 0.406: R9.1 29.84,55.88 Q9.D
  Bottom 0.406: Q10.G 31.75,55.24 Q9.D | R9.1 R10.1
N$10
  Top 0.406: R10.2 29.21,63.5 D5.K
N$11
  Top 0.406: R51.1 113.67,55.88 Q43.D
  Bottom 0.406: Q44.G 115.57,55.24 Q43.D | R51.1 R52.1
N$12
  Top 0.406: R11.1 36.2,55.88 Q11.D
  Bottom 0.406: Q12.G 38.1,55.24 Q11.D | R11.1 R12.1
N$13
  Top 0.406: R12.2 35.56,63.5 D6.K
N$14
  Top 0.406: R13.1 42.55,55.88 Q13.D
  Bottom 0.406: Q14.G 44.45,55.24 Q13.D | R13.1 R14.1
N$15
  Top 0.406: R14.2 41.91,63.5 D7.K
N$16
  Top 0.406: R15.1 48.9,55.88 Q15.D
  Bottom 0.406: Q16.G 50.8,55.24 Q15.D | R16.1 R15.1
N$17
  Top 0.406: R16.2 48.26,63.5 D8.K
N$18
  Top 0.406: R52.2 113.03,63.5 D9.K
N$19
  Top 0.406: R53.1 120.02,55.88 Q45.D
  Bottom 0.406: Q46.G 121.92,55.24 Q45.D | R53.1 R54.1
N$20
  Top 0.406: R54.2 119.38,63.5 D10.K
N$21
  Top 0.406: R55.1 126.36,55.88 Q47.D
  Bottom 0.406: R55.1 R56.1 | Q48.G 128.27,55.24 Q47.D
N$22
  Top 0.406: R56.2 125.73,63.5 D11.K
N$23
  Top 0.406: R57.1 132.72,55.88 Q49.D
  Bottom 0.406: R57.1 R58.1 | Q50.G 134.62,55.24 Q49.D
N$24
  Top 0.406: R58.2 132.08,63.5 D12.K
N$25
  Top 0.406: R59.1 139.06,55.88 Q51.D
  Bottom 0.406: R59.1 R60.1 | Q52.G 140.97,55.24 Q51.D
N$26
  Top 0.406: R60.2 138.43,63.5 D13.K
N$27
  Top 0.406: R61.1 145.41,55.88 Q53.D
  Bottom 0.406: R61.1 R62.1 | Q54.G 147.32,55.24 Q53.D
N$28
  Top 0.406: R62.2 144.78,63.5 D14.K
N$29
  Top 0.406: R63.1 151.76,55.88 Q55.D
  Bottom 0.406: R63.1 R64.1 | Q56.G 153.67,55.24 Q55.D
N$30
  Top 0.406: R64.2 151.13,63.5 D15.K
N$31
  Top 0.406: R65.1 158.12,55.88 Q57.D
  Bottom 0.406: R65.1 R66.1 | Q58.G 160.02,55.24 Q57.D
N$32
  Top 0.406: R66.2 157.48,63.5 D16.K
N$33
  Top 0.406: Q237.S 176.53,5.71 161.93,5.71 Q239.D
N$34  (via drill 0.5 pad 1.02)
  Top 0.406: Q241.S 185.42,5.71 184.15,6.99 168.91,6.99 v168.28,7.62
  Bottom 0.406: v168.28,7.62 167,6.35 Q243.D
N$65  (via drill 0.5 pad 1.02)
  Top 0.406: Q174.D 10.79,47.62 v9.53,46.35 | v10.79,41.27 19.05,41.27 19.68,40.64 23.5,40.64 24.13,41.27 29.84,41.27 v30.48,40.64
  Bottom 0.406: v9.53,46.35 9.53,45.09 10.79,43.81 v10.79,41.27 | v30.48,40.64 30.48,38.1 31.11,37.47 36.2,37.47 36.83,36.83 R204.1 36.83,31.75 38.73,29.84 R203.1 Q175.G
N$66
  Bottom 0.406: R204.2 36.2,27.94 36.2,22.23 D33.K
N$69  (via drill 0.5 pad 1.02)
  Top 0.406: v12.7,38.73 13.97,37.47 69.22,37.47 69.85,38.1 118.75,38.1 v119.38,37.47
  Bottom 0.406: Q174.S v12.7,38.73 | v119.38,37.47 119.38,46.99 120.02,47.62 Q176.D
N$70  (via drill 0.5 pad 1.02)
  Top 0.406: v22.86,39.37 23.5,39.37 24.13,38.73 27.3,38.73 v27.94,39.37
  Bottom 0.406: Q179.D 20.32,46.35 21.59,46.35 22.86,45.09 v22.86,39.37 | v27.94,39.37 27.94,36.83 29.21,35.56 30.48,35.56 31.11,34.92 R206.1 31.11,31.75 33.02,29.84 R205.1 Q180.G
N$71
  Bottom 0.406: R206.2 30.48,27.94 30.48,22.23 D34.K
N$74  (via drill 0.5 pad 1.02)
  Top 0.406: v19.05,39.37 20.32,38.1 68.58,38.1 69.22,38.73 125.09,38.73 v125.73,38.1
  Bottom 0.406: Q179.S v19.05,39.37 | v125.73,38.1 125.73,46.99 126.36,47.62 Q181.D
N$75
  Bottom 0.406: Q184.D 26.67,46.35 26.67,38.1 25.4,36.83 R208.1 25.4,31.75 27.3,29.84 R207.1 Q185.G
N$76
  Bottom 0.406: R208.2 24.77,27.94 24.77,22.23 D35.K
N$79  (via drill 0.5 pad 1.02)
  Top 0.406: v25.4,40.01 26.04,40.64 28.57,40.64 30.48,38.73 67.94,38.73 68.58,39.37 131.44,39.37 v132.08,38.73
  Bottom 0.406: Q184.S v25.4,40.01 | v132.08,38.73 132.08,46.99 132.72,47.62 Q186.D
N$80  (via drill 0.5 pad 1.02)
  Top 0.406: v33.02,41.91 v20.32,41.91
  Bottom 0.406: Q189.D 33.02,46.35 v33.02,41.91 | v20.32,41.91 20.32,35.56 19.68,34.92 R210.1 19.68,31.75 21.59,29.84 R209.1 Q190.G
N$81
  Bottom 0.406: R210.2 19.05,27.94 19.05,22.23 D36.K
N$84  (via drill 0.5 pad 1.02)
  Top 0.406: v31.75,40.64 32.38,40.01 137.79,40.01 v138.43,39.37
  Bottom 0.406: Q189.S v31.75,40.64 | v138.43,39.37 138.43,46.99 139.06,47.62 Q191.D
N$85  (via drill 0.5 pad 1.02)
  Top 0.406: Q194.D 38.1,46.99 39.37,45.72 39.37,44.45 38.73,43.81 36.83,43.81 35.56,45.09 33.66,45.09 32.38,43.81 30.48,43.81 29.84,44.45 27.3,44.45 26.67,43.81 23.5,43.81 22.86,44.45 20.32,44.45 19.68,43.81 17.78,43.81 v17.14,43.18
  Bottom 0.406: v17.14,43.18 15.88,41.91 15.88,36.83 13.97,34.92 R212.1 13.97,31.75 15.88,29.84 R211.1 Q195.G
N$86
  Bottom 0.406: R212.2 13.97,27.94 13.34,27.3 13.34,22.23 D37.K
N$89  (via drill 0.5 pad 1.02)
  Top 0.406: v38.1,41.27 38.73,40.64 144.15,40.64 v144.78,40.01
  Bottom 0.406: Q194.S v38.1,41.27 | v144.78,40.01 144.78,46.99 145.41,47.62 Q196.D
N$90  (via drill 0.5 pad 1.02)
  Top 0.406: Q199.D 42.55,47.62 41.91,46.99 40.01,46.99 39.37,47.62 39.37,48.26 38.73,48.9 36.83,48.9 34.92,46.99 33.66,46.99 33.02,47.62 33.02,48.26 32.38,48.9 30.48,48.9 28.57,46.99 27.3,46.99 26.67,47.62 26.67,48.26 26.04,48.9 24.13,48.9 22.23,46.99 20.95,46.99 20.32,47.62 20.32,48.26 19.68,48.9 17.78,48.9 15.88,46.99 14.61,46.99 v13.97,46.35
  Bottom 0.406: v13.97,46.35 13.97,36.83 13.34,36.2 9.53,36.2 8.26,34.92 R214.1 8.26,31.75 10.16,29.84 R213.1 Q200.G
N$91
  Bottom 0.406: R214.2 8.26,27.94 7.62,27.3 7.62,22.23 D38.K
N$94  (via drill 0.5 pad 1.02)
  Top 0.406: v44.45,41.91 45.09,41.27 150.5,41.27 v151.13,40.64
  Bottom 0.406: Q199.S v44.45,41.91 | v151.13,40.64 151.13,46.99 151.76,47.62 Q201.D
N$95  (via drill 0.5 pad 1.02)
  Top 0.406: Q204.D 50.8,48.26 49.53,49.53 v6.99,49.53
  Bottom 0.406: v6.99,49.53 6.99,48.9 7.62,47.62 7.62,41.27 8.26,40.64 8.26,36.83 7.62,36.2 3.17,36.2 2.54,35.56 R216.1 2.54,31.75 4.45,29.84 R215.1 Q205.G
N$96
  Bottom 0.406: R216.2 2.54,27.94 1.91,27.3 1.91,22.23 D39.K
N$99  (via drill 0.5 pad 1.02)
  Top 0.406: v157.48,41.91 51.44,41.91 v50.8,42.55
  Bottom 0.406: Q206.D 158.12,47.62 157.48,46.99 v157.48,41.91 | v50.8,42.55 Q204.S
N$133
  Top 0.406: Q169.D 7.62,46.35 7.62,40.01 5.71,38.1 5.71,36.83 6.35,36.2 41.91,36.2 42.55,35.56 R202.1
  Bottom 0.406: R202.1 42.55,31.75 44.45,29.84 R201.1 Q170.G
N$134
  Bottom 0.406: R202.2 41.91,27.94 41.91,22.23 D69.K
N$137  (via drill 0.5 pad 1.02)
  Top 0.406: v6.99,37.47 7.62,36.83 69.85,36.83 70.48,37.47 112.39,37.47 v113.03,36.83
  Bottom 0.406: Q169.S 6.35,38.1 v6.99,37.47 | v113.03,36.83 113.03,46.99 113.67,47.62 Q171.D
P0_A0
  Top 0.406: J2.5 80.01,67.31 75.56,62.87 75.56,51.44 78.11,48.9 Q17.D 78.11,44.45 R25.1
P0_A1
  Bottom 0.406: J2.6 78.74,71.75 78.74,63.5 R26.1 78.11,60.33 Q18.D
P0_A2
  Top 0.406: J2.7 82.55,66.67 79.38,63.5 79.38,51.44 81.92,48.9 Q19.D R27.1
P0_A3
  Bottom 0.406: J2.8 83.82,71.75 83.82,64.14 83.19,63.5 83.19,60.33 R28.1 Q20.D
P0_A4
  Top 0.406: J2.9 85.09,64.77 83.19,62.87 83.19,51.44 85.72,48.9 Q21.D 85.72,44.45 R29.1
P0_A5
  Bottom 0.406: J2.10 86.36,71.75 86.36,63.5 R30.1 85.72,60.33 Q22.D
P0_A6
  Top 0.406: J2.11 87.63,57.78 87,57.15 87,51.44 89.53,48.9 Q33.D R41.1
P0_A7
  Bottom 0.406: J2.12 88.9,71.75 88.9,67.94 90.81,66.04 90.81,60.33 R42.1 Q34.D
P0_A8
  Top 0.406: J2.13 90.17,66.67 90.81,66.04 90.81,51.44 93.34,48.9 Q35.D 93.34,44.45 R43.1
P0_A9
  Bottom 0.406: J2.14 91.44,71.75 91.44,62.23 R44.1 93.34,60.33 Q36.D
P0_A10
  Top 0.406: J2.15 92.71,66.67 94.61,64.77 94.61,51.44 97.16,48.9 Q37.D R45.1
P0_A11
  Bottom 0.406: J2.16 93.98,71.75 93.98,62.23 R46.1 Q38.D
P0_A12
  Top 0.406: J2.17 95.25,66.04 98.42,62.87 98.42,51.44 100.97,48.9 Q39.D 100.97,44.45 R47.1
P0_A13
  Bottom 0.406: J2.18 96.52,71.75 96.52,64.77 R48.1 100.97,60.33 Q40.D
P0_A14
  Top 0.406: J2.19 97.79,66.67 102.23,62.23 102.23,51.44 104.78,48.9 Q41.D R49.1
P0_A15
  Bottom 0.406: J2.20 100.33,70.48 100.33,63.5 R50.1 Q42.D
P0_CS
  Top 0.406: R246.1 71.12,47.62 Q240.D
  Bottom 0.406: Q23.G Q240.D
P0_CS_N
  Top 0.406: R31.1 70.48,54.61 Q23.D
  Bottom 0.406: R31.1 70.48,56.52 69.22,57.78 69.22,62.87 74.93,68.58 J2.1
P0_RD0
  Bottom 0.406: Q1.G 6.35,62.87 10.79,67.31 20.32,67.31 20.95,67.94 20.95,71.12 J1.2
P0_RD0_B
  Bottom 0.406: Q2.D 5.08,48.9 | 5.08,48.9 Q169.G | R17.1 4.45,48.26 5.08,48.9
P0_RD1
  Bottom 0.406: Q3.G 12.7,60.33 13.34,60.96 13.34,65.41 14.61,66.67 22.86,66.67 25.4,69.22 J1.3
P0_RD1_B
  Bottom 0.406: Q4.D 11.43,48.26 | 11.43,48.26 Q174.G | R18.1 11.43,48.26
P0_RD2
  Bottom 0.406: Q5.G 19.05,58.42 22.86,62.23 22.86,65.41 26.67,68.58 26.67,71.75 J1.4
P0_RD2_B
  Bottom 0.406: Q6.D 17.78,48.26 | 17.78,48.26 Q179.G | R19.1 17.78,48.26
P0_RD3
  Bottom 0.406: Q7.G 25.4,62.87 27.94,65.41 J1.5
P0_RD3_B
  Bottom 0.406: Q8.D 24.13,48.26 | 24.13,48.26 Q184.G | R20.1 24.13,48.26
P0_RD4
  Bottom 0.406: Q9.G 31.75,60.33 31.11,60.96 29.84,60.96 29.21,61.59 29.21,71.75 J1.6
P0_RD4_B
  Bottom 0.406: Q10.D 30.48,48.26 | 30.48,48.26 Q189.G | R21.1 30.48,48.26
P0_RD5
  Bottom 0.406: J1.7 30.48,67.94 32.38,66.04 32.38,62.23 33.66,60.96 36.83,60.96 38.1,59.69 Q11.G
P0_RD5_B
  Bottom 0.406: Q12.D 36.83,48.26 | 36.83,48.26 Q194.G | R22.1 36.83,48.26
P0_RD6
  Top 0.406: Q13.G 44.45,65.41 43.81,66.04 34.29,66.04 31.75,68.58 31.75,71.75 J1.8
P0_RD6_B
  Bottom 0.406: Q14.D 43.18,48.26 | 43.18,48.26 Q199.G | R23.1 43.18,48.26
P0_RD7
  Bottom 0.406: J1.9 33.02,67.31 34.29,66.04 44.45,66.04 45.72,64.77 45.72,62.23 46.99,60.96 50.16,60.96 50.8,60.33 Q15.G
P0_RD7_B
  Bottom 0.406: Q16.D 49.53,48.26 | 49.53,48.26 Q204.G | R24.1 49.53,48.26
P0_WD0
  Top 0.406: J1.12 36.83,71.75 36.83,67.94 38.1,66.67 52.07,66.67 53.34,65.41 53.34,51.44 55.88,48.9 Q25.D 55.88,45.09 R33.1
P0_WD1
  Bottom 0.406: J1.13 38.1,67.94 39.37,66.67 53.98,66.67 54.61,66.04 R34.1 55.88,60.33 Q26.D
P0_WD2
  Top 0.406: Q27.D 59.69,48.9 57.15,51.44 57.15,66.04 55.88,67.31 40.64,67.31 39.37,68.58 39.37,71.75 J1.14
  Bottom 0.406: Q27.D R35.1
P0_WD3
  Bottom 0.406: J1.15 40.64,68.58 41.91,67.31 57.78,67.31 58.42,66.67 58.42,60.33 R36.1 Q28.D
P0_WD4
  Top 0.406: J1.16 41.91,71.75 41.91,69.22 43.18,67.94 59.69,67.94 60.96,66.67 60.96,51.44 63.5,48.9 Q29.D 63.5,45.09 R37.1
P0_WD5
  Bottom 0.406: J1.17 43.18,69.22 44.45,67.94 61.59,67.94 62.23,67.31 R38.1 63.5,60.33 Q30.D
P0_WD6
  Top 0.406: Q31.D 67.31,48.9 64.77,51.44 64.77,67.31 63.5,68.58 45.72,68.58 44.45,69.85 44.45,71.75 J1.18
  Bottom 0.406: Q31.D R39.1
P0_WD7
  Bottom 0.406: J1.19 47.62,68.58 64.77,68.58 66.04,67.31 66.04,59.69 66.67,59.05 R40.1 Q32.D
P0_WE_N
  Bottom 0.406: J2.3 77.47,66.67 74.3,63.5 R32.1 73.03,60.96 Q24.D
P1_A0
  Bottom 0.406: R85.1 187.32,44.45 Q69.D 186.06,49.53 186.06,51.44 186.69,52.07 187.96,52.07 188.59,52.7 188.59,64.77 189.23,65.41 J4.5
P1_A1
  Bottom 0.406: Q70.D 187.32,60.33 R86.1 186.06,65.41 187.96,67.31 187.96,71.75 J4.6
P1_A2
  Top 0.406: J4.7 188.59,67.31 188.59,51.44 191.13,48.9 Q71.D
  Bottom 0.406: Q71.D R87.1
P1_A3
  Bottom 0.406: Q72.D R88.1 189.87,60.33 189.87,64.14 190.5,64.77 190.5,71.75 J4.8
P1_A4
  Top 0.406: R89.1 194.94,44.45 Q73.D 194.94,48.9 192.41,51.44 192.41,67.94 194.31,69.85 J4.9
P1_A5
  Bottom 0.406: Q74.D 194.94,60.33 R90.1 193.04,62.23 193.04,71.75 J4.10
P1_A6
  Top 0.406: J4.11 196.85,68.58 196.22,67.94 196.22,51.44 198.75,48.9 Q75.D
  Bottom 0.406: Q75.D R91.1
P1_A7
  Bottom 0.406: Q76.D R92.1 196.85,60.96 196.85,62.87 198.12,64.14 198.12,71.75 J4.12
P1_A8
  Top 0.406: R93.1 202.56,44.45 Q77.D 202.56,48.9 200.03,51.44 200.03,62.87 199.39,63.5 J4.13
P1_A9
  Bottom 0.406: Q78.D 202.56,60.33 R94.1 200.66,62.23 200.66,71.75 J4.14
P1_A10
  Top 0.406: J4.15 201.93,66.67 203.84,64.77 203.84,51.44 206.38,48.9 Q79.D
  Bottom 0.406: Q79.D R95.1
P1_A11
  Bottom 0.406: Q80.D R96.1 203.2,62.23 203.2,71.75 J4.16
P1_A12
  Top 0.406: R97.1 210.19,44.45 Q81.D 210.19,48.9 207.65,51.44 207.65,63.5 204.47,66.67 J4.17
P1_A13
  Bottom 0.406: Q82.D 210.19,60.33 R98.1 208.91,64.14 205.74,67.31 205.74,71.75 J4.18
P1_A14
  Top 0.406: J4.19 207.01,67.31 211.46,62.87 211.46,51.44 214,48.9 Q83.D
  Bottom 0.406: Q83.D R99.1
P1_A15
  Bottom 0.406: Q84.D R100.1 211.46,61.59 211.46,63.5 208.91,66.04 208.91,71.12 J4.20
P1_CS
  Top 0.406: R248.1 182.88,48.26 Q244.D
  Bottom 0.406: Q244.D Q59.G
P1_CS_N
  Top 0.406: R75.1 179.71,54.61 Q59.D
  Bottom 0.406: J4.1 177.8,64.14 177.8,57.78 R75.1
P1_RD0
  Bottom 0.406: J3.2 131.44,73.03 130.18,71.75 130.18,69.85 129.54,69.22 117.47,69.22 115.57,67.31 Q43.G
P1_RD0_B
  Top 0.406: Q171.G 114.3,48.26 | 114.3,48.26 Q44.D | R67.1 114.3,48.26
P1_RD1
  Bottom 0.406: J3.3 134.62,69.85 133.35,68.58 123.19,68.58 121.92,67.31 Q45.G
P1_RD1_B
  Top 0.406: Q176.G 120.65,48.26 | 120.65,48.26 Q46.D | R68.1 120.65,48.26
P1_RD2
  Bottom 0.406: J3.4 135.89,71.75 135.89,69.22 134.62,67.94 128.91,67.94 128.27,67.31 Q47.G
P1_RD2_B
  Top 0.406: Q181.G 127,48.26 | 127,48.26 Q48.D | R69.1 127,48.26
P1_RD3
  Bottom 0.406: J3.5 137.16,69.22 134.62,66.67 Q49.G
P1_RD3_B
  Top 0.406: Q186.G 133.35,48.26 | 133.35,48.26 Q50.D | R70.1 133.35,48.26
P1_RD4
  Bottom 0.406: J3.6 138.43,71.75 138.43,58.42 139.06,57.78 Q51.G
P1_RD4_B
  Top 0.406: Q191.G 139.7,48.26 | 139.7,48.26 Q52.D | R71.1 139.7,48.26
P1_RD5
  Bottom 0.406: J3.7 139.7,67.31 141.6,65.41 141.6,62.87 143.51,60.96 146.69,60.96 147.32,60.33 Q53.G
P1_RD5_B
  Top 0.406: Q196.G 146.05,48.26 | 146.05,48.26 Q54.D | R72.1 146.05,48.26
P1_RD6
  Bottom 0.406: J3.8 139.7,72.39 140.97,71.12 140.97,67.94 142.88,66.04 147.32,66.04 147.96,65.41 147.96,62.87 149.86,60.96 153.03,60.96 153.67,60.33 Q55.G
P1_RD6_B
  Top 0.406: Q201.G 152.4,48.26 | 152.4,48.26 Q56.D | R73.1 152.4,48.26
P1_RD7
  Bottom 0.406: J3.9 142.24,67.94 143.51,66.67 148.59,66.67 149.22,66.04 153.03,66.04 154.31,64.77 154.31,62.23 155.57,60.96 159.38,60.96 160.02,60.33 Q57.G
P1_RD7_B
  Top 0.406: Q206.G 158.75,48.26 | 158.75,48.26 Q58.D | R74.1 158.75,48.26
P1_WD0
  Top 0.406: J3.12 146.05,71.75 146.05,68.58 147.32,67.31 161.29,67.31 162.56,66.04 162.56,50.8 Q61.D
  Bottom 0.406: Q61.D 165.1,44.45 R77.1
P1_WD1
  Bottom 0.406: J3.13 147.96,70.48 151.76,66.67 163.19,66.67 163.83,66.04 R78.1 165.1,60.33 Q62.D
P1_WD2
  Top 0.406: J3.14 148.59,71.75 148.59,68.58 149.22,67.94 165.1,67.94 166.37,66.67 166.37,51.44 168.91,48.9 Q63.D
  Bottom 0.406: Q63.D R79.1
P1_WD3
  Bottom 0.406: J3.15 153.03,67.31 165.1,67.31 166.37,66.04 166.37,61.59 R80.1 Q64.D
P1_WD4
  Top 0.406: J3.16 151.13,71.75 151.13,69.85 152.4,68.58 168.91,68.58 170.18,67.31 170.18,51.44 172.72,48.9 Q65.D 172.72,45.09 R81.1
P1_WD5
  Bottom 0.406: J3.17 154.31,68.58 170.18,68.58 171.45,67.31 R82.1 172.72,60.33 Q66.D
P1_WD6
  Top 0.406: J3.18 153.67,71.75 155.57,71.75 158.12,69.22 172.72,69.22 173.99,67.94 173.99,51.44 176.53,48.9 Q67.D
  Bottom 0.406: Q67.D R83.1
P1_WD7
  Bottom 0.406: J3.19 156.21,69.22 172.72,69.22 173.99,67.94 173.99,61.59 R84.1 Q68.D
P1_WE_N
  Bottom 0.406: Q60.D 182.25,60.96 R76.1 183.51,64.14 186.69,67.31 J4.3
RD0
  Bottom 0.406: R257.1 46.35,25.4 Q170.D 44.45,23.5 44.45,19.68 40.64,15.88 40.64,5.08 J9.2
RD1
  Bottom 0.406: R258.1 40.64,25.4 Q175.D 40.01,22.86 38.73,21.59 38.73,18.41 39.37,17.78 J9.3
RD2
  Bottom 0.406: R259.1 34.92,25.4 Q180.D 34.29,22.86 36.2,20.95 36.2,13.34 38.1,11.43 38.1,5.08 J9.4
RD3
  Bottom 0.406: R260.1 29.21,25.4 Q185.D 28.57,22.86 30.48,20.95 30.48,11.43 31.11,10.79 36.2,10.79 36.83,10.16 J9.5
RD4
  Bottom 0.406: R253.1 23.5,25.4 Q190.D 22.86,22.86 24.77,20.95 24.77,10.79 25.4,10.16 34.92,10.16 35.56,9.53 35.56,5.08 J9.6
RD5
  Bottom 0.406: R254.1 17.78,25.4 Q195.D 17.14,22.86 19.05,20.95 19.05,10.16 19.68,9.53 33.66,9.53 34.29,8.89 J9.7
RD6
  Bottom 0.406: R255.1 12.06,25.4 Q200.D 11.43,22.86 13.34,20.95 13.34,10.16 14.61,8.89 32.38,8.89 33.02,8.26 33.02,5.08 J9.8
RD7
  Bottom 0.406: R256.1 6.35,25.4 Q205.D 5.71,22.86 7.62,20.95 7.62,9.53 8.89,8.26 31.11,8.26 31.75,7.62 J9.9
SEL_A0
  Top 0.406: Q241.G 184.15,5.71 183.51,6.35 167,6.35 166.37,6.99 R241.1
  Bottom 0.406: Q233.D 165.74,8.26 R241.1
SEL_A0_N  (via drill 0.5 pad 1.02)
  Top 0.406: Q233.G 162.56,9.53 163.19,10.16 172.72,10.16 v173.35,9.53
  Bottom 0.406: TP1.P$1 154.31,9.53 Q233.G | v173.35,9.53 173.35,3.81 173.99,3.17 Q237.G
WD0  (via drill 0.5 pad 1.02)
  Top 0.406: J9.12 30.48,5.08 30.48,7.62 31.11,8.26 55.24,8.26 v56.52,9.53
  Bottom 0.406: v56.52,9.53 Q209.G
WD0_N  (via drill 0.5 pad 1.02)
  Top 0.406: v57.15,33.02 57.78,33.66 131.44,33.66 132.08,33.02 158.12,33.02 158.75,33.66 R217.1
  Bottom 0.406: Q25.G v57.15,33.02 57.15,25.4 Q209.D | Q61.G 163.19,49.53 161.93,48.26 161.93,43.18 160.02,41.27 160.02,36.2 159.38,35.56 R217.1
WD1  (via drill 0.5 pad 1.02)
  Top 0.406: J9.13 26.67,6.99 28.57,8.89 52.07,8.89 v52.7,9.53
  Bottom 0.406: v52.7,9.53 Q210.G
WD1_N  (via drill 0.5 pad 1.02)
  Top 0.406: v53.34,34.29 132.08,34.29 132.72,33.66 155.57,33.66 156.21,34.29 156.21,36.83 156.84,37.47 R218.1
  Bottom 0.406: Q26.G 53.34,53.34 v53.34,34.29 53.34,25.4 Q210.D | Q62.G 161.29,52.07 161.29,43.81 158.75,41.27 R218.1
WD2  (via drill 0.5 pad 1.02)
  Top 0.406: J9.14 25.4,5.08 25.4,6.99 27.94,9.53 50.8,9.53 55.88,14.61 v64.14,14.61
  Bottom 0.406: v64.14,14.61 Q211.G
WD2_N  (via drill 0.5 pad 1.02)
  Top 0.406: v60.96,31.75 61.59,32.38 130.18,32.38 130.81,31.75 165.74,31.75 166.37,32.38 R219.1
  Bottom 0.406: Q27.G v60.96,31.75 65.41,27.3 Q211.D | Q63.G 170.18,43.18 167.64,40.64 167.64,36.83 R219.1
WD3  (via drill 0.5 pad 1.02)
  Top 0.406: J9.15 24.13,6.99 27.3,10.16 50.16,10.16 55.88,15.88 v60.33,15.88
  Bottom 0.406: v60.33,15.88 Q212.G
WD3_N  (via drill 0.5 pad 1.02)
  Top 0.406: v58.42,32.38 59.05,33.02 130.81,33.02 131.44,32.38 163.19,32.38 163.83,33.02 163.83,36.83 164.47,37.47 R220.1
  Bottom 0.406: Q28.G v58.42,32.38 58.42,27.94 Q212.D | Q64.G 167.64,44.45 166.37,43.18 R220.1
WD4  (via drill 0.5 pad 1.02)
  Top 0.406: J9.16 22.86,5.08 22.86,7.62 26.04,10.79 49.53,10.79 55.88,17.14 68.58,17.14 69.22,17.78 v71.75,17.78
  Bottom 0.406: v71.75,17.78 Q213.G
WD4_N  (via drill 0.5 pad 1.02)
  Top 0.406: v68.58,30.48 69.22,31.11 128.91,31.11 129.54,30.48 168.28,30.48 168.91,31.11 R221.1
  Bottom 0.406: Q29.G 64.77,32.38 66.67,30.48 v68.58,30.48 73.03,26.04 Q213.D | Q65.G 173.99,41.27 171.45,38.73 171.45,36.83 170.18,35.56 R221.1
WD5  (via drill 0.5 pad 1.02)
  Top 0.406: J9.17 21.59,7.62 25.4,11.43 48.9,11.43 55.88,18.41 v67.94,18.41
  Bottom 0.406: v67.94,18.41 Q214.G
WD5_N  (via drill 0.5 pad 1.02)
  Top 0.406: v64.14,31.11 64.77,31.75 129.54,31.75 130.18,31.11 167,31.11 167.64,31.75 167.64,36.83 168.28,37.47 R222.1
  Bottom 0.406: Q30.G 62.23,47.62 63.5,46.35 63.5,31.75 v64.14,31.11 69.22,26.04 Q214.D | Q66.G 171.45,47.62 172.72,46.35 172.72,41.27 R222.1
WD6
  Top 0.406: J9.18 20.32,5.08 20.32,7.62 24.77,12.06 48.26,12.06 55.88,19.68 78.74,19.68 79.38,20.32 Q215.G
WD6_N  (via drill 0.5 pad 1.02)
  Top 0.406: v73.66,29.21 74.3,29.84 127.64,29.84 128.27,29.21 175.9,29.21 176.53,29.84 R223.1
  Bottom 0.406: Q31.G 68.58,34.29 v73.66,29.21 76.2,26.67 78.74,26.67 Q215.D | Q67.G 177.8,36.2 177.16,35.56 R223.1
WD7
  Top 0.406: J9.19 19.05,7.62 24.13,12.7 47.62,12.7 55.24,20.32 74.93,20.32 75.56,20.95 Q216.G
WD7_N  (via drill 0.5 pad 1.02)
  Top 0.406: v71.12,29.84 71.75,30.48 128.27,30.48 128.91,29.84 174.62,29.84 175.26,30.48 175.26,36.83 175.9,37.47 R224.1
  Bottom 0.406: Q32.G 66.04,34.92 v71.12,29.84 76.2,24.77 Q216.D | Q68.G 175.26,38.73 R224.1
WE  (via drill 0.5 pad 1.02)
  Top 0.406: v71.75,35.56 72.39,34.92 v139.7,34.92 143.51,38.73 152.4,38.73 152.4,40.01 153.03,40.64 v180.97,40.64
  Bottom 0.406: Q60.G 182.25,59.69 182.25,57.15 180.97,55.88 v180.97,40.64 | Q24.G 73.03,59.69 73.03,57.15 71.75,55.88 v71.75,35.56 | v139.7,34.92 139.7,6.35 | Q236.D 139.7,6.35 | 139.7,6.35 R244.1
WE_N
  Bottom 0.406: J10.3 116.84,5.08 119.38,5.08 121.92,7.62 134.62,7.62 Q236.G

## Text on the board
tPlace: Rd: | 0 | 1 | 2 | 3 | 4 | 5 | 6 | 7 | Rd: | 0 | 1 | 2 | 3 | 4 | 5 | 6 | 7 | Channel / 0 | Channel / 1 | Mux Rd. Data | Wr. Data Buffer | 7 | 6 | 5 | 4 | 3 | 2 | 1 | 0 | Address Buffer | Address Select | MEM_MUX_2W_1 | James Newman | Upstream Data | Upstream Addr | +5V | 0V